# EAGLE design doorbell (EAGLE 7.6.0)
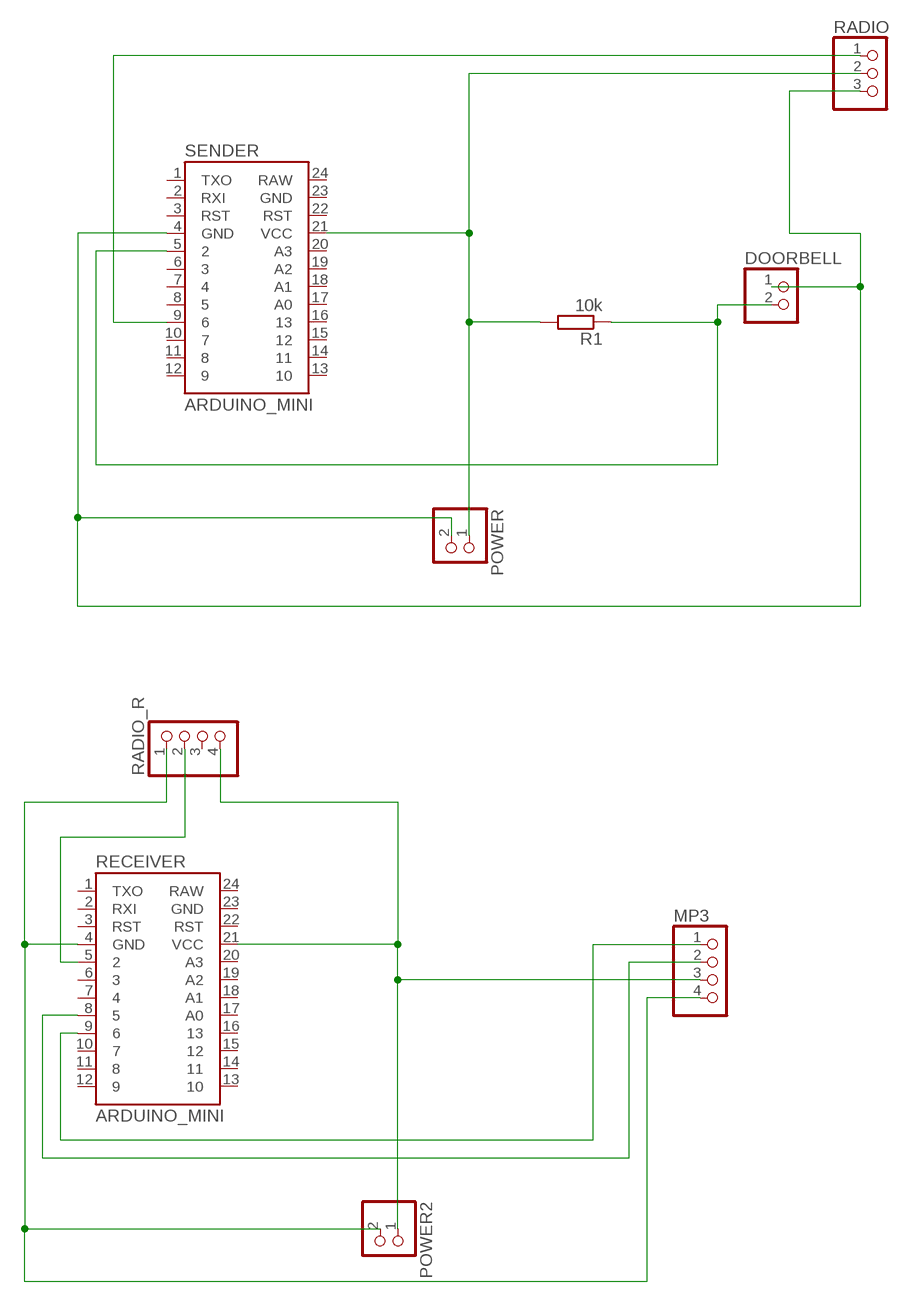
[diagram p0: schematic, sheet 1]

## Parts
DOORBELL  PINHD-1X2/90  [1X02/90]
MP3  PINHD-1X4/90  [1X04/90]
POWER  PINHD-1X2/90  [1X02/90]
POWER2  PINHD-1X2/90  [1X02/90]
R1  10k  R0207/10  [0207/10]
RADIO  PINHD-1X3/90  [1X03/90]
RADIO_R  PINHD-1X4/90  [1X04/90]
RECEIVER  ARDUINO_MINI  [ARDUINO_MINI]
SENDER  ARDUINO_MINI  [ARDUINO_MINI]

## Nets
5V: POWER.1 R1.2 RADIO.2 SENDER.21(VCC)
5V_2: MP3.3 POWER2.1 RADIO_R.4 RECEIVER.21(VCC)
5V_R: DOORBELL.2 R1.1 SENDER.5
DATA: RADIO_R.2 RECEIVER.5
GND: DOORBELL.1 POWER.2 RADIO.3 SENDER.4(GND)
GND2: MP3.4 POWER2.2 RADIO_R.1 RECEIVER.4(GND)
RADIO: RADIO.1 SENDER.9
RX-TX: MP3.2 RECEIVER.8
TX-RX: MP3.1 RECEIVER.9
Unconnected: RADIO_R.3 RECEIVER.1(TXO) RECEIVER.2(RXI) RECEIVER.3(RST) RECEIVER.6 RECEIVER.7 RECEIVER.10 RECEIVER.11 RECEIVER.12 RECEIVER.13 RECEIVER.14 RECEIVER.15 RECEIVER.16 RECEIVER.17(A0) RECEIVER.18(A1) RECEIVER.19(A2) RECEIVER.20(A3) RECEIVER.22(RST) RECEIVER.23(GND) RECEIVER.24(RAW) SENDER.1(TXO) SENDER.2(RXI) SENDER.3(RST) SENDER.6 SENDER.7 SENDER.8 SENDER.10 SENDER.11 SENDER.12 SENDER.13 SENDER.14 SENDER.15 SENDER.16 SENDER.17(A0) SENDER.18(A1) SENDER.19(A2) SENDER.20(A3) SENDER.22(RST) SENDER.23(GND) SENDER.24(RAW)

## Library data of the parts
DOORBELL POWER POWER2 = pinhead:PINHD-1X2: PIN HEADER
MP3 RADIO_R = pinhead:PINHD-1X4: PIN HEADER
R1 = eagle-ltspice:R: RESISTOR, European symbol; SPICEMODEL: NONE; SPICEPREFIX: R
RADIO = pinhead:PINHD-1X3: PIN HEADER
RECEIVER SENDER = SparkFun-Boards:ARDUINO_MINI: Arduino Pro Mini footprint

## Board
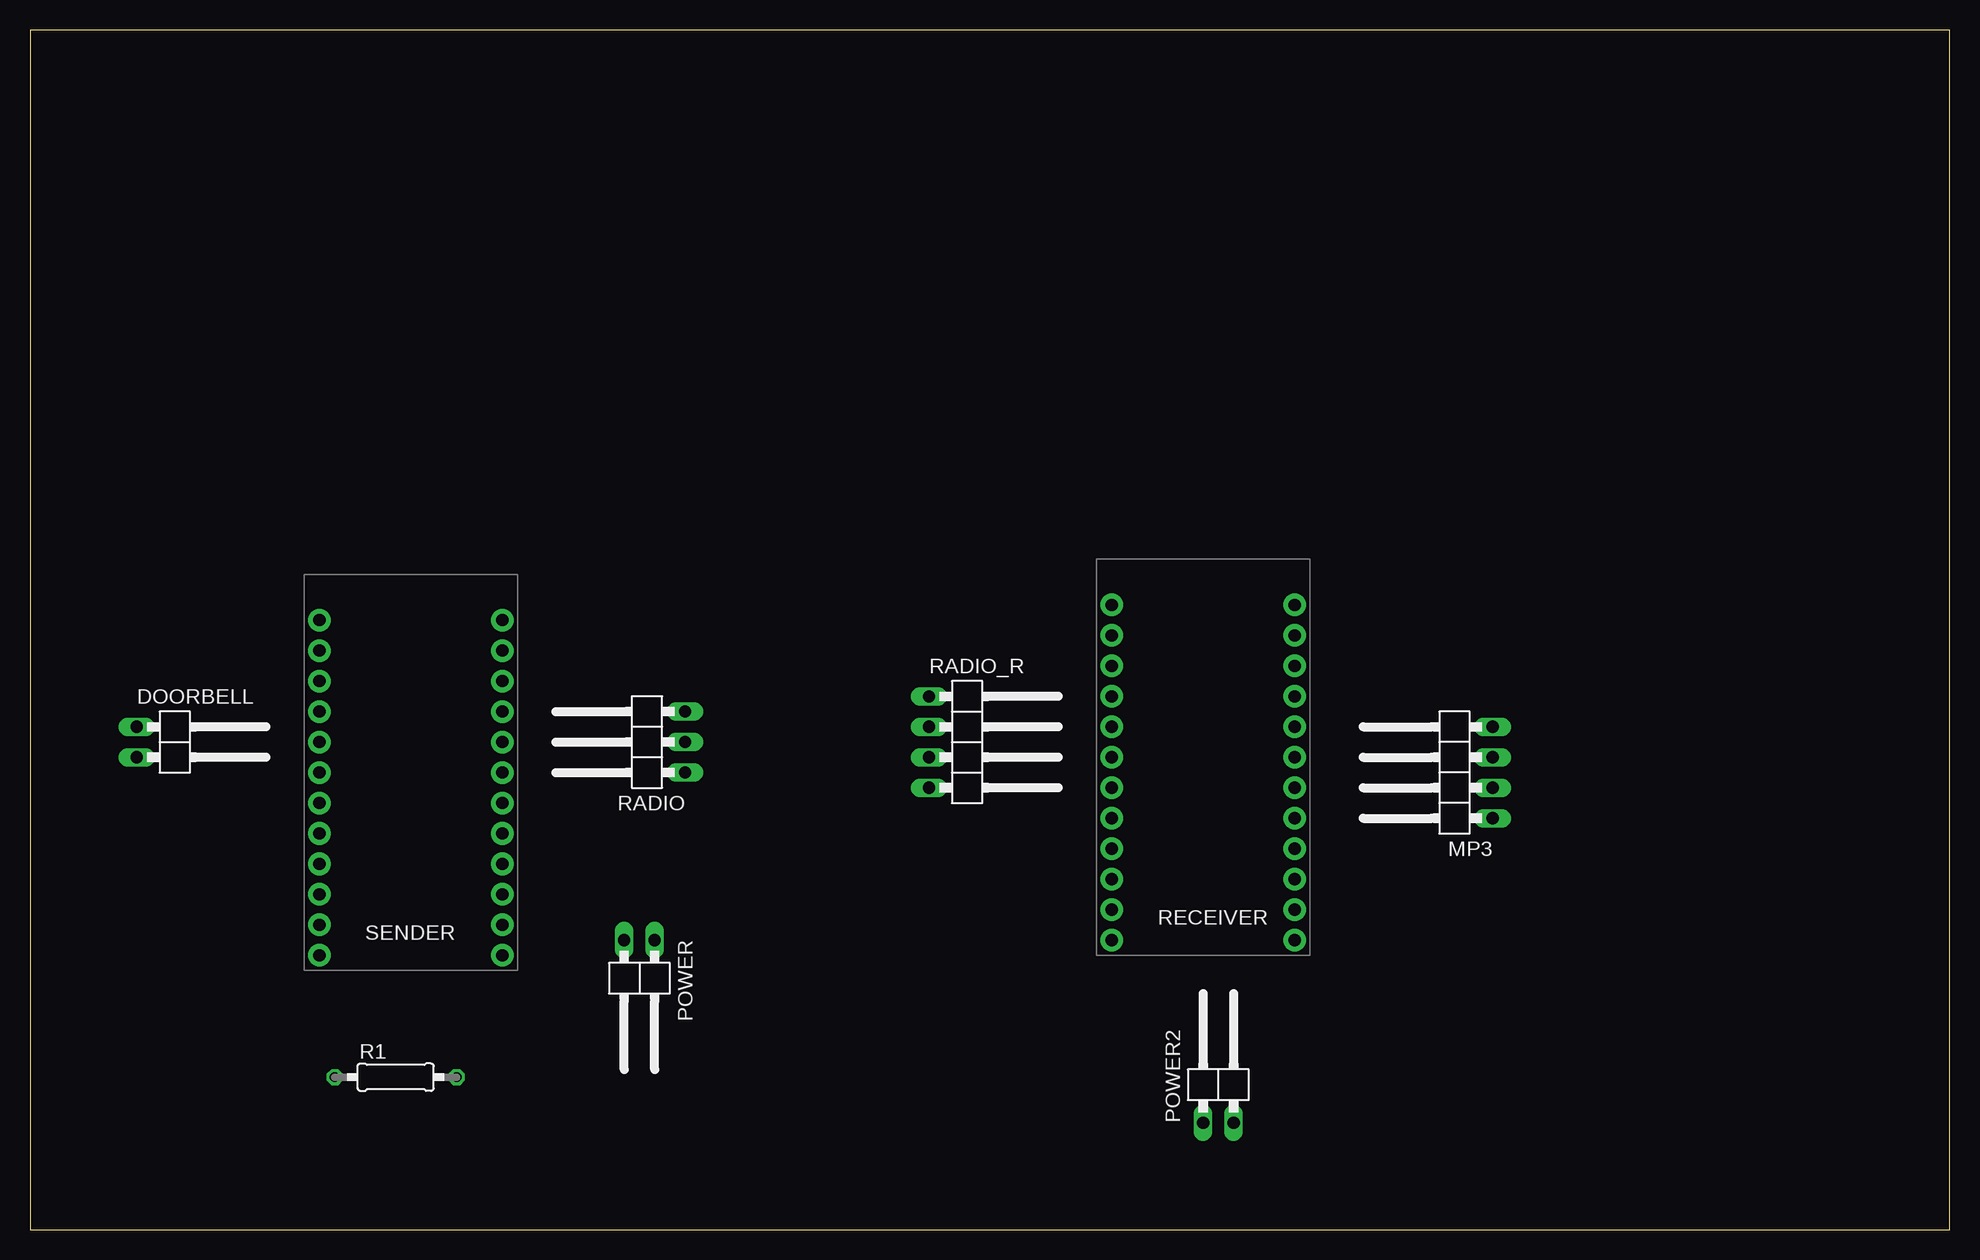
[diagram p1: board, top side]
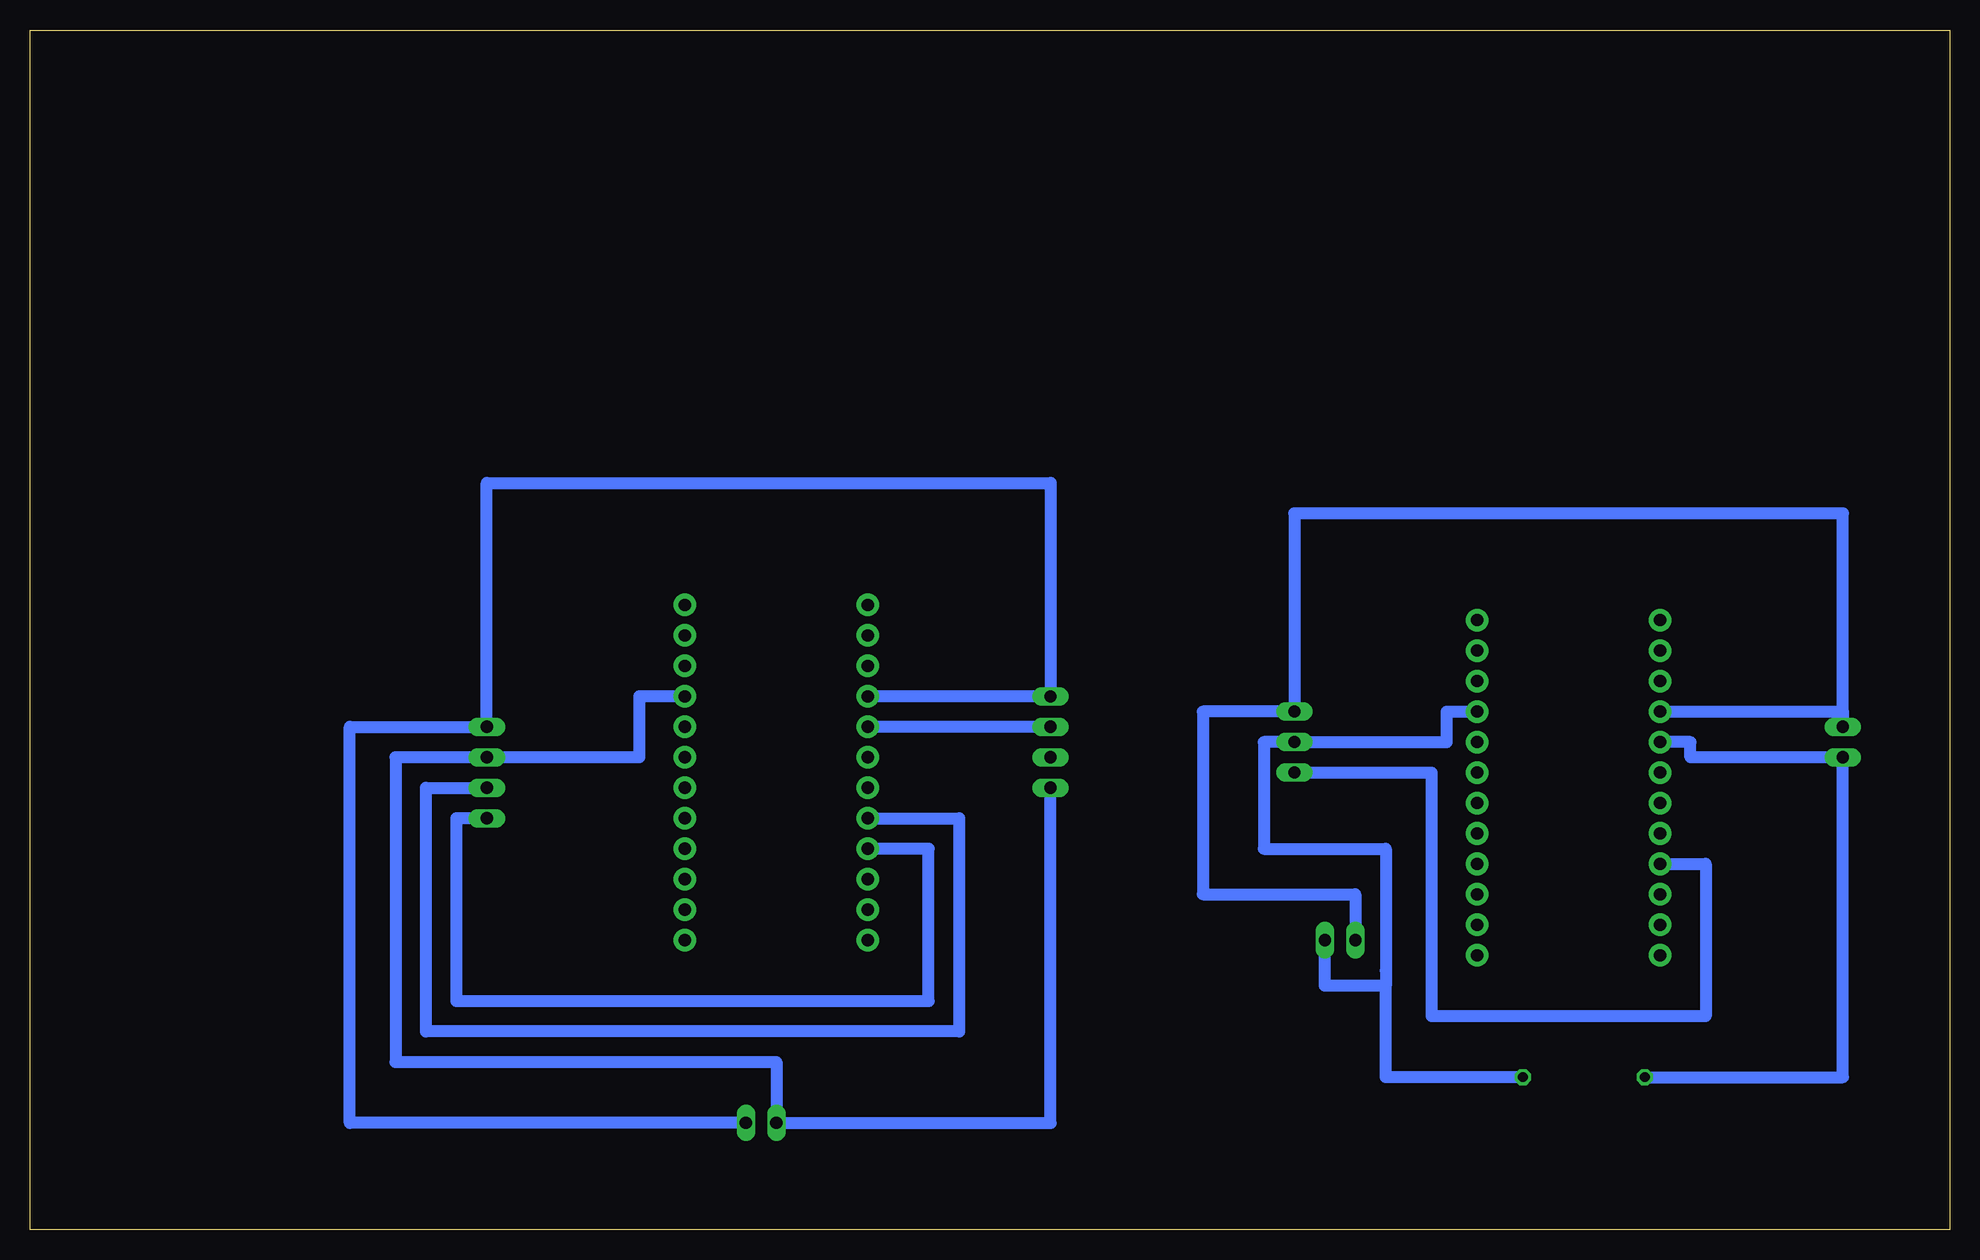
[diagram p2: board, bottom side, seen from below]

Size 160 x 100 mm. Coordinates in mm from the lower left corner, seen from the top.
Outline: 0,0 160,0 160,100 0,100 0,0
Copper layers (1*16): Top 0.035mm / dielectric 1.5mm / Bottom 0.035mm
Design rules "default": minimum track width 10mil, minimum drill 24mil, track to track 8mil, track to pad 8mil, pad to pad 8mil, via to via 8mil, smd to smd 8mil, copper to edge 40mil, drill to drill 8mil, minimum pad ring 10mil, minimum via ring 8mil, stop-mask expansion 4mil, vias tented up to drill 0mil, thermal gap 10mil

### Footprints (pad centres in the part's own frame; a part is rotated, then mirrored left to right if it is on the bottom)
1X02/90 = drill 1.016 long: 1 -1.27,-3.81; 2 1.27,-3.81
1X04/90 = drill 1.016 long: 1 -3.81,-3.81; 2 -1.27,-3.81; 3 1.27,-3.81; 4 3.81,-3.81
0207/10 = drill 0.813 octagon: 1 -5.08,0; 2 5.08,0
1X03/90 = drill 1.016 long: 1 -2.54,-3.81; 2 0,-3.81; 3 2.54,-3.81
ARDUINO_MINI = drill 1.016 pad 1.88: 1 -7.62,12.7; 2 -7.62,10.16; 3 -7.62,7.62; 4 -7.62,5.08; 5 -7.62,2.54; 6 -7.62,0; 7 -7.62,-2.54; 8 -7.62,-5.08; 9 -7.62,-7.62; 10 -7.62,-10.16; 11 -7.62,-12.7; 12 -7.62,-15.24; 13 7.62,-15.24; 14 7.62,-12.7; 15 7.62,-10.16; 16 7.62,-7.62; 17 7.62,-5.08; 18 7.62,-2.54; 19 7.62,0; 20 7.62,2.54; 21 7.62,5.08; 22 7.62,7.62; 23 7.62,10.16; 24 7.62,12.7

### Placement (x,y rotation side)
DOORBELL  12.7,40.64 270 top
MP3  118.11,38.1 90 top
POWER  50.8,20.32 180 top
POWER2  99.06,12.7 0 top
R1  30.48,12.7 0 top
RADIO  50.8,40.64 90 top
RADIO_R  78.74,40.64 270 top
RECEIVER  97.79,39.37 0 top
SENDER  31.75,38.1 0 top

### Tracks (layer width: path | path; a pad name or v marks a point on that pad's centre or on a via)
5V
  Bottom 1.016: SENDER.21 41.91,43.18 41.91,40.64 RADIO.2 57.15,40.64 57.15,31.75 46.99,31.75 46.99,21.59 46.99,20.32 | 46.99,20.32 52.07,20.32 POWER.1 | R1.2 46.99,12.7 46.99,20.32
5V_2
  Bottom 1.016: RADIO_R.4 74.93,8.89 POWER2.1 97.79,13.97 129.54,13.97 129.54,39.37 MP3.3 109.22,39.37 109.22,44.45 RECEIVER.21
5V_R
  Bottom 1.016: R1.1 8.89,12.7 DOORBELL.2 21.59,39.37 21.59,40.64 SENDER.5
DATA
  Bottom 1.016: RADIO_R.2 RECEIVER.5
GND
  Bottom 1.016: SENDER.4 8.89,43.18 DOORBELL.1 8.89,59.69 54.61,59.69 RADIO.3 62.23,43.18 62.23,27.94 49.53,27.94 POWER.2
GND2
  Bottom 1.016: POWER2.2 133.35,8.89 133.35,41.91 MP3.4 121.92,62.23 74.93,62.23 RADIO_R.1 RECEIVER.4
RADIO
  Bottom 1.016: RADIO.1 43.18,38.1 43.18,17.78 20.32,17.78 20.32,30.48 SENDER.9
RX-TX
  Bottom 1.016: RECEIVER.8 82.55,34.29 82.55,16.51 127,16.51 127,36.83 MP3.2
TX-RX
  Bottom 1.016: MP3.1 124.46,34.29 124.46,19.05 85.09,19.05 85.09,31.75 RECEIVER.9